# Altium schematic sheet Main_Block_Diagram.SchDoc: Main Block Diagram Sheet
size A3; Author: Kubilay Közleme; Organization: My Company; Address1: Address Line 1; Address2: Address Line 2; Address3: Address Line 3; Address4: Address Line 4; DocumentNumber: 1; SheetNumber: 1; SheetTotal: 5; ProjectTitle: Drone Fligth Controller
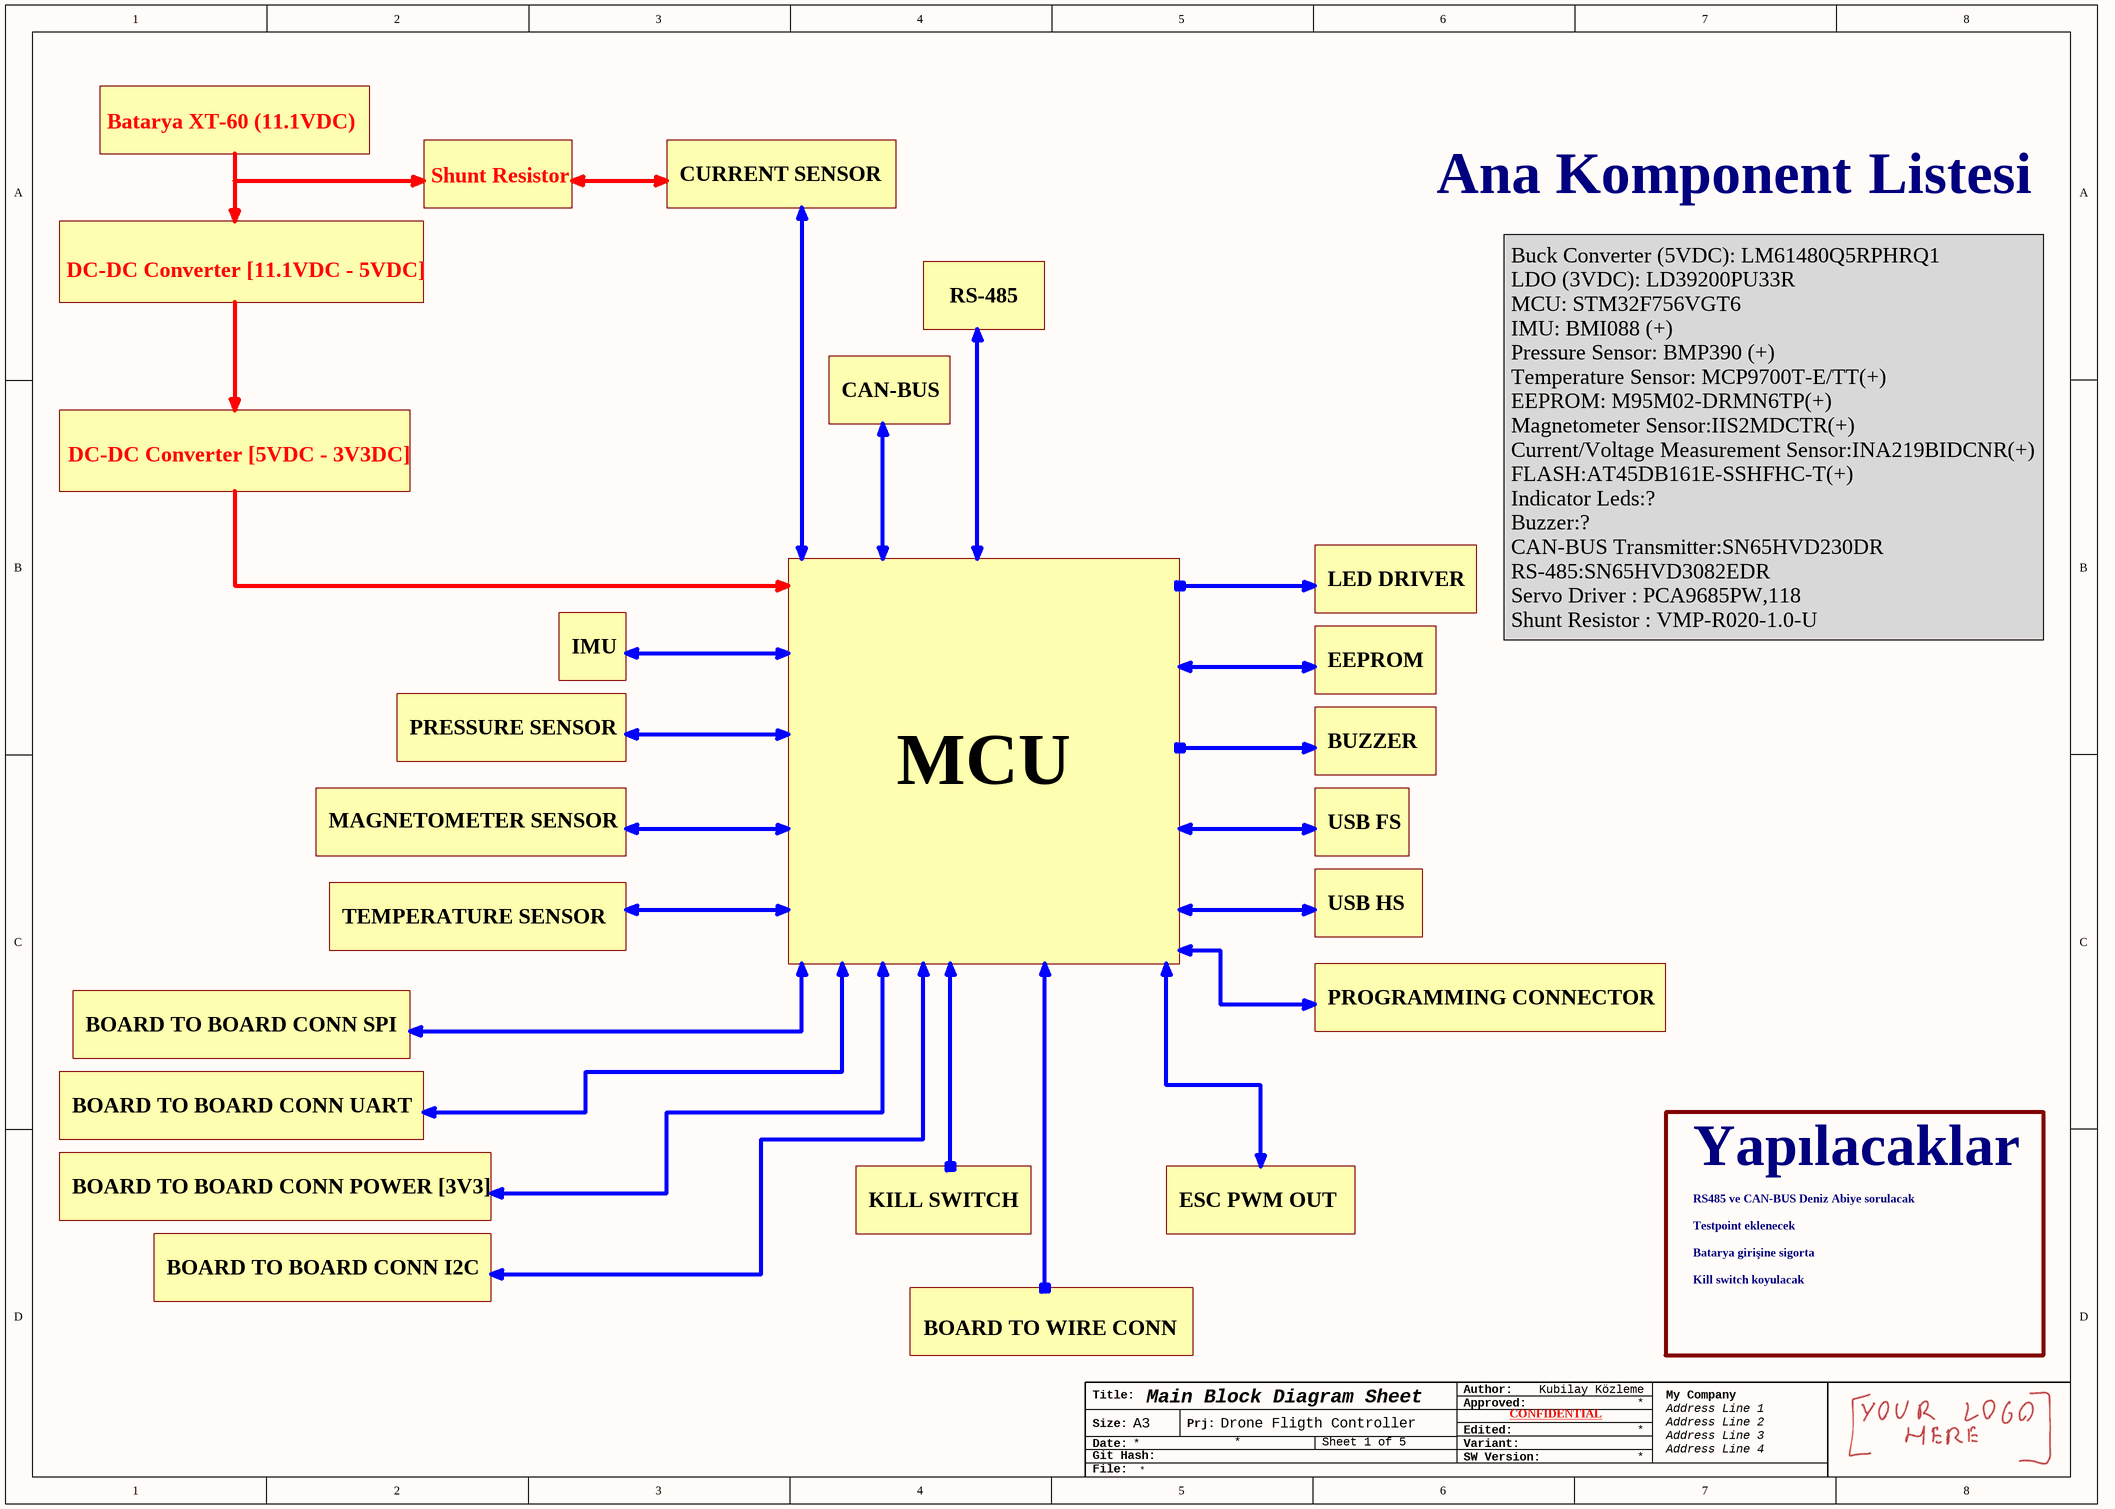
[diagram p0: Main_Block_Diagram.SchDoc]

## Notes on the sheet
- Batarya XT-60 (11.1VDC)
- CURRENT SENSOR
- Shunt Resistor
- Ana Komponent
- Listesi
- DC-DC Converter [11.1VDC - 5VDC]
- Batarya karta bağlanıp akımı ölçülecek
  Buck Converter Tasarımı Yapılacak
- RS-485
- CAN-BUS
- DC-DC Converter [5VDC - 3V3DC]
- LDO Tasarımı Yapılacak Buradaki 3V3 uçuş bilgisayarı içinde kullanılacak
- Led sürücü olarak transistör kullanılacak
- LED DRIVER
- Buck Converter (5VDC): LM61480Q5RPHRQ1
  LDO (3VDC): LD39200PU33R
  MCU: STM32F756VGT6
  IMU: BMI088 (+)
  Pressure Sensor: BMP390 (+)
  Temperature Sensor: MCP9700T-E/TT(+)
  EEPROM: M95M02-DRMN6TP(+)
  Magnetometer Sensor:IIS2MDCTR(+)
  Current/Voltage Measurement Sensor:INA219BIDCNR(+)
  FLASH:AT45DB161E-SSHFHC-T(+)
  Indicator Leds:?
  Buzzer:?
  CAN-BUS Transmitter:SN65HVD230DR
  RS-485:SN65HVD3082EDR
  Servo Driver : PCA9685PW,118
  Shunt Resistor : VMP-R020-1.0-U
- IMU
- EEPROM
- PRESSURE SENSOR
- BUZZER
- MAGNETOMETER SENSOR
- MCU
- USB FS
- USB HS
- TEMPERATURE SENSOR
- BOARD TO BOARD CONN SPI
- PROGRAMMING CONNECTOR
- BOARD TO BOARD CONN UART
- Yapılacaklar
- BOARD TO BOARD CONN POWER [3V3]
- KILL SWITCH
- ESC PWM OUT
- Testpoint eklenecek
- Batarya girişine sigorta
- RS485 ve CAN-BUS Deniz Abiye sorulacak
- BOARD TO BOARD CONN I2C
- Kill switch koyulacak
- BOARD TO WIRE CONN
- Title:
- Author:
- Approved:
- Size:
- Date:
- Git Hash:
- A3
- Prj:
- SW Version:
- Variant:
- Edited:
- CONFIDENTIAL
- File: